# EAGLE design Mechaduino01 (EAGLE 7.3.0)
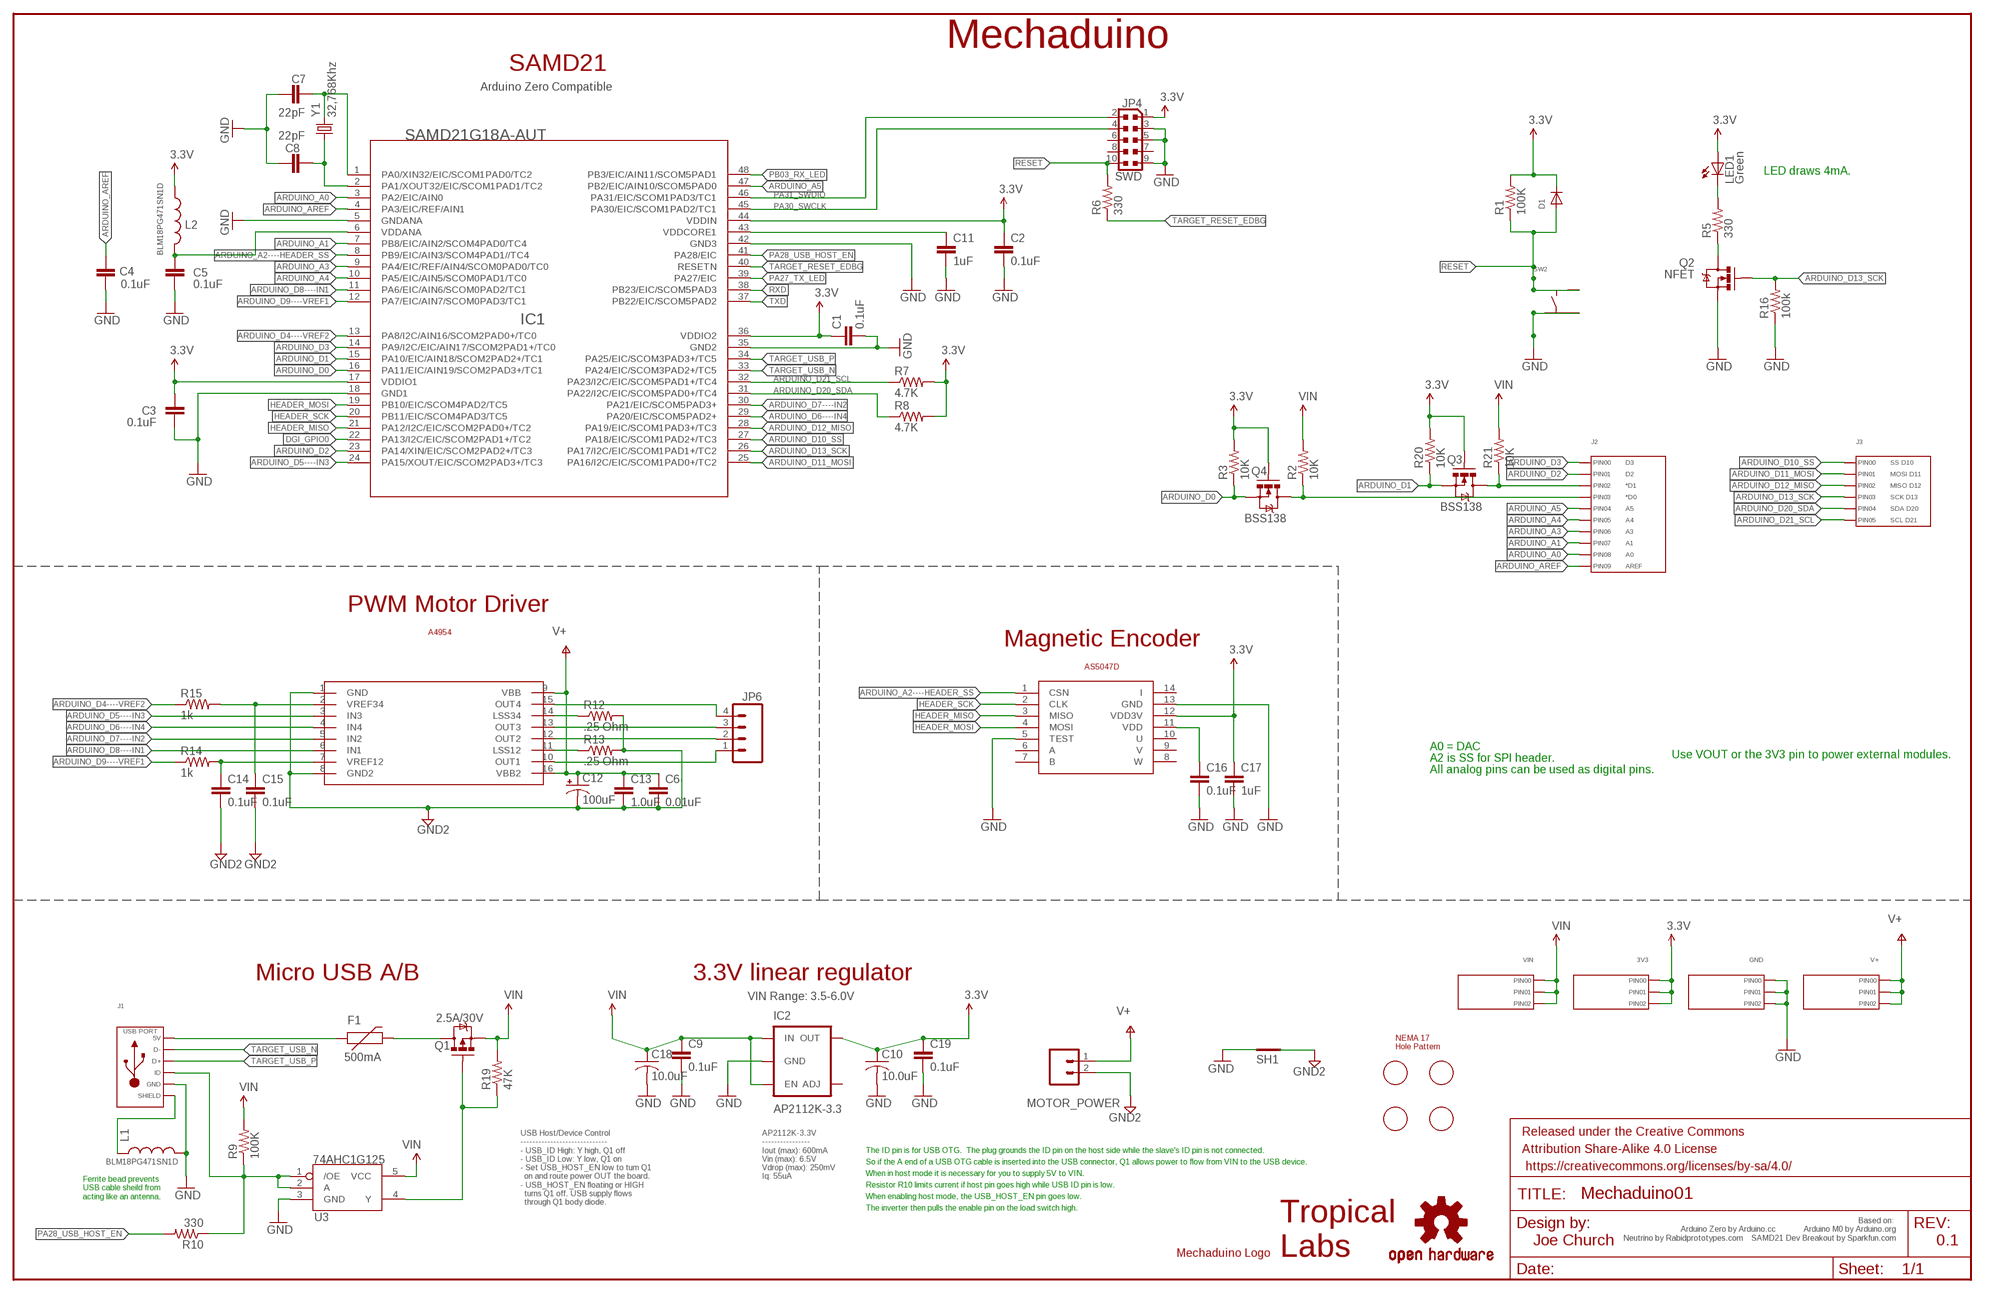
[diagram p0: schematic, sheet 1]

## Parts
3V3  HEADER_01X03_PTH_2.54MM  [PTH_2.54MM_01X03]
C1  0.1uF  CAP0402  [0402-CAP]
C2  0.1uF  CAP0402  [0402-CAP]
C3  0.1uF  CAP0402  [0402-CAP]
C4  0.1uF  CAP0402  [0402-CAP]
C5  0.1uF  CAP0402  [0402-CAP]
C6  0.01uF  CAP0402  [0402-CAP]
C7  22pF  CAP0402  [0402-CAP]
C8  22pF  CAP0402  [0402-CAP]
C9  0.1uF  CAP0402  [0402-CAP]
C10  10.0uF  C-USC0805  [C0805]
C11  1uF  CAP0402  [0402-CAP]
C12  100uF  CAP_POLD  [PANASONIC_D]
C13  1.0uF  CAP0603  [0603-CAP]
C14  0.1uF  CAP0402  [0402-CAP]
C15  0.1uF  CAP0402  [0402-CAP]
C16  0.1uF  CAP0402  [0402-CAP]
C17  1uF  CAP0402  [0402-CAP]
C18  10.0uF  C-USC0805  [C0805]
C19  0.1uF  CAP0402  [0402-CAP]
D1  DIODESOD-523  [SOD-523]
F1  500mA  PTCSMD  [PTC-1206]
FRAME1  FRAME-LEDGER  [CREATIVE_COMMONS]
GND  HEADER_01X03_PTH_2.54MM  [PTH_2.54MM_01X03]
IC1  SAMD21G18A-AUT  INTEGRATEDCIRCUITS_1792_SAMD21G18A-AUT  [INTEGRATEDCIRCUITS_TQFP48-7X7]
IC2  AP2112K-3.3  AP2202-ADJ  [SOT23-5@1]
J1  USB_MICRO_RIGHT  [MICROUSB-RIGHT]
J2  HEADER_01X10_PTH_2.54MM  [PTH_2.54MM_01X10]
J3  HEADER_01X06_PTH_2.54MM  [PTH_2.54MM_01X06]
JP4  SWD  CONNETTORI_0171_PH127-205DF055G00A  [CONNETTORI_PINHEAD-2X5-P127]
JP6  M04PTH  [1X04]
L1  BLM18PG471SN1D  INDUCTOR0603-TDK  [0603-TDK]
L2  BLM18PG471SN1D  INDUCTOR0603-TDK  [0603-TDK]
LED1  Green  0044_KPT-2012YC  [CHIPLED_0805]
LOGO4  OSHW-LOGOL-COPPER  [OSHW-LOGO-L_COPPER]
MOTOR_POWER  M025MM  [SCREWTERMINAL-5MM-2]
Q1  2.5A/30V  MOSFET-PCHANNELDMG2307L  [SOT23-3]
Q2  NFET  MOSFET-NCHANNEL2N7002PW  [SOT323]
Q3  BSS138  MOSFET-NCHANNELSMD  [SOT23-3]
Q4  BSS138  MOSFET-NCHANNELSMD  [SOT23-3]
R1  100K  R-US_R0402-VISHAY  [R0402-VISHAY]
R2  10K  R-US_R0402-VISHAY  [R0402-VISHAY]
R3  10K  R-US_R0402-VISHAY  [R0402-VISHAY]
R5  330  R-US_R0402-VISHAY  [R0402-VISHAY]
R6  330  R-US_R0402-VISHAY  [R0402-VISHAY]
R7  4.7K  R-US_R0402-VISHAY  [R0402-VISHAY]
R8  4.7K  R-US_R0402-VISHAY  [R0402-VISHAY]
R9  100K  R-US_R0402-VISHAY  [R0402-VISHAY]
R10  330  R-US_R0402-VISHAY  [R0402-VISHAY]
R12  .25 Ohm  R-US_R1206  [R1206]
R13  .25 Ohm  R-US_R1206  [R1206]
R14  1k  R-US_R0402-VISHAY  [R0402-VISHAY]
R15  1k  R-US_R0402-VISHAY  [R0402-VISHAY]
R16  100k  R-US_R0402-VISHAY  [R0402-VISHAY]
R19  47K  47KOHM1/10W1%(0603)  [0603-RES]
R20  10K  R-US_R0402-VISHAY  [R0402-VISHAY]
R21  10K  R-US_R0402-VISHAY  [R0402-VISHAY]
SH1  SHORT-HA5  [SHORT_ALL-50]
SW2  TACT_4.2MM  [TACT4.2MM]
U3  74AHC1G125  [SOT23-5]
U$1  AVAGO_DRIVER  [TSSOP16]
U$2  NEMA17_HOLE_PATTERN  [NEMA17_HOLE_PATTERN]
U$3  TROPICAL_LABS_LOGO_1LOGO3  [LOGO3]
U$4  AS5047D  [TSSOP14]
U$5  MECHADUINO_LOGO  [MECHADUINO_LOGO]
V+  HEADER_01X03_PTH_2.54MM  [PTH_2.54MM_01X03]
VIN  HEADER_01X03_PTH_2.54MM  [PTH_2.54MM_01X03]
Y1  32,768Khz  CRYSTAL2012  [CRYSTAL-SMD-2.0X1.2]

## Nets
3.3V: 3V3.P$1(PIN0) 3V3.P$2(PIN1) 3V3.P$3(PIN2) C1.1 C2.1 C3.2 C10.1 C17.1 C19.1 D1.K(C) IC1.17(VDDIO1) IC1.36(VDDIO2) IC1.44(VDDIN) IC2.5(OUT) JP4.1 L2.1 LED1.A Q3.1(G) Q4.1(G) R1.2 R3.2 R7.2 R8.2 R20.2 U$4.12(VDD3V)
ARDUINO_A0: IC1.3(PA2/EIC/AIN0) J2.P$9(PIN8)
ARDUINO_A1: IC1.7(PB8/EIC/AIN2/SCOM4PAD0/TC4) J2.P$8(PIN7)
ARDUINO_A2----HEADER_SS: IC1.8(PB9/EIC/AIN3/SCOM4PAD1//TC4) U$4.1(CSN)
ARDUINO_A3: IC1.9(PA4/EIC/REF/AIN4/SCOM0PAD0/TC0) J2.P$7(PIN6)
ARDUINO_A4: IC1.10(PA5/EIC/AIN5/SCOM0PAD1/TC0) J2.P$6(PIN5)
ARDUINO_A5: IC1.47(PB2/EIC/AIN10/SCOM5PAD0) J2.P$5(PIN4)
ARDUINO_AREF: C4.1 IC1.4(PA3/EIC/REF/AIN1) J2.P$10(PIN9)
ARDUINO_D0: IC1.16(PA11/EIC/AIN19/SCOM2PAD3+/TC1) Q4.2(S) R3.1
ARDUINO_D1: IC1.15(PA10/EIC/AIN18/SCOM2PAD2+/TC1) Q3.2(S) R20.1
ARDUINO_D2: IC1.23(PA14/XIN/EIC/SCOM2PAD2+/TC3) J2.P$2(PIN1)
ARDUINO_D3: IC1.14(PA9/I2C/EIC/AIN17/SCOM2PAD1+/TC0) J2.P$1(PIN0)
ARDUINO_D4----VREF2: IC1.13(PA8/I2C/AIN16/SCOM2PAD0+/TC0) R15.1
ARDUINO_D5----IN3: IC1.24(PA15/XOUT/EIC/SCOM2PAD3+/TC3) U$1.3(IN3)
ARDUINO_D6----IN4: IC1.29(PA20/EIC/SCOM5PAD2+) U$1.4(IN4)
ARDUINO_D7----IN2: IC1.30(PA21/EIC/SCOM5PAD3+) U$1.5(IN2)
ARDUINO_D8----IN1: IC1.11(PA6/EIC/AIN6/SCOM0PAD2/TC1) U$1.6(IN1)
ARDUINO_D9----VREF1: IC1.12(PA7/EIC/AIN7/SCOM0PAD3/TC1) R14.1
ARDUINO_D10_SS: IC1.27(PA18/EIC/SCOM1PAD2+/TC3) J3.P$1(PIN0)
ARDUINO_D11_MOSI: IC1.25(PA16/I2C/EIC/SCOM1PAD0+/TC2) J3.P$2(PIN1)
ARDUINO_D12_MISO: IC1.28(PA19/EIC/SCOM1PAD3+/TC3) J3.P$3(PIN2)
ARDUINO_D13_SCK: IC1.26(PA17/I2C/EIC/SCOM1PAD1+/TC2) J3.P$4(PIN3) Q2.1(G) R16.2
ARDUINO_D20_SDA: IC1.31(PA22/I2C/EIC/SCOM5PAD0+/TC4) J3.P$5(PIN4) R8.1
ARDUINO_D21_SCL: IC1.32(PA23/I2C/EIC/SCOM5PAD1+/TC4) J3.P$6(PIN5) R7.1
DGI_GPIO0: IC1.22(PA13/I2C/EIC/SCOM2PAD1+/TC2)
GND [gnd]: C1.2 C2.2 C3.1 C4.2 C5.2 C7.1 C8.1 C9.2 C10.2 C11.2 C16.2 C17.2 C18.2 C19.2 GND.P$1(PIN0) GND.P$2(PIN1) GND.P$3(PIN2) IC1.5(GNDANA) IC1.18(GND1) IC1.35(GND2) IC1.42(GND3) IC2.2(GND) J1.5(GND) JP4.3 JP4.5 JP4.9 L1.2 Q2.2(S) R16.1 SH1.2 SW2.P$3 SW2.P$4 U3.3(GND) U$4.5(TEST) U$4.13(GND)
GND2 [gnd]: C6.2 C12.- C13.2 C14.2 C15.2 MOTOR_POWER.2 R12.2 R13.2 SH1.1 U$1.1(GND) U$1.8(GND2)
HEADER_MISO: IC1.21(PA12/I2C/EIC/SCOM2PAD0+/TC2) U$4.3(MISO)
HEADER_MOSI: IC1.19(PB10/EIC/SCOM4PAD2/TC5) U$4.4(MOSI)
HEADER_SCK: IC1.20(PB11/EIC/SCOM4PAD3/TC5) U$4.2(CLK)
HV1: J2.P$3(PIN2) Q3.3(D) R21.1
HV2: J2.P$4(PIN3) Q4.3(D) R2.1
N$1: LED1.C R5.2
N$2: R12.1 U$1.14(LSS34)
N$3: Q2.3(D) R5.1
N$4: R13.1 U$1.11(LSS12)
N$6: C15.1 R15.2 U$1.2(VREF34)
N$7: J1.4(ID) R9.1 R10.1 U3.1(/OE) U3.2(A)
N$13: JP6.4 U$1.15(OUT4)
N$14: JP6.1 U$1.10(OUT1)
N$15: JP6.2 U$1.12(OUT2)
N$16: JP6.3 U$1.13(OUT3)
N$27: C16.1 U$4.11(VDD)
N$32: C14.1 R14.2 U$1.7(VREF12)
N$33: F1.2 Q1.3(D)
N$34: Q1.1(G) R19.1 U3.4(Y)
N$36 [usbvcc]: F1.1 J1.1(5V)
PA00_XIN32: C7.2 IC1.1(PA0/XIN32/EIC/SCOM1PAD0/TC2) Y1.2
PA01_XOUT32: C8.2 IC1.2(PA1/XOUT32/EIC/SCOM1PAD1/TC2) Y1.1
PA27_TX_LED: IC1.39(PA27/EIC)
PA28_USB_HOST_EN: IC1.41(PA28/EIC) R10.2
PA30_SWCLK: IC1.45(PA30/EIC/SCOM1PAD2/TC1) JP4.4
PA31_SWDIO: IC1.46(PA31/EIC/SCOM1PAD3/TC1) JP4.2
PB03_RX_LED: IC1.48(PB3/EIC/AIN11/SCOM5PAD1)
RESET: D1.A JP4.10 R1.1 R6.2 SW2.P$1 SW2.P$2
RXD: IC1.38(PB23/EIC/SCOM5PAD3)
SHIELD [gnd]: J1.S1(SLD) J1.S2(SLD) J1.S3(SLD) J1.S4(SLD) J1.S5(SLD) J1.S6(SLD) J1.S7(SLD) J1.S8(SLD) L1.1
TARGET_RESET_EDBG: IC1.40(RESETN) R6.1
TARGET_USB_N [USBpair]: IC1.33(PA24/EIC/SCOM3PAD2+/TC5) J1.2(D-)
TARGET_USB_P [USBpair]: IC1.34(PA25/EIC/SCOM3PAD3+/TC5) J1.3(D+)
TXD: IC1.37(PB22/EIC/SCOM5PAD2)
V+: C6.1 C12.+ C13.1 MOTOR_POWER.1 U$1.9(VBB) U$1.16(VBB2) V+.P$1(PIN0) V+.P$2(PIN1) V+.P$3(PIN2)
VDDANA: C5.1 IC1.6(VDDANA) L2.2
VDDCORE: C11.1 IC1.43(VDDCORE1)
VIN [usbvcc]: C9.1 C18.1 IC2.1(IN) IC2.3(EN) Q1.2(S) R2.2 R9.2 R19.2 R21.2 U3.5(VCC) VIN.P$1(PIN0) VIN.P$2(PIN1) VIN.P$3(PIN2)
Unconnected: IC2.4(ADJ) JP4.6 JP4.7 JP4.8 U$4.6(A) U$4.7(B) U$4.8(W) U$4.9(V) U$4.10(U) U$4.14(I)

## Notes on the sheet
- Mechaduino
- SAMD21
- Arduino Zero Compatible
- LED draws 4mA.
- PWM Motor Driver
- A4954
- Magnetic Encoder
- A0 = DAC | Use VOUT or the 3V3 pin to power external modules.
- A2 is SS for SPI header.
- All analog pins can be used as digital pins.
- Micro USB A/B | 3.3V linear regulator
- VIN Range: 3.5-6.0V
- USB Host/Device Control
  -----------------------------
  - USB_ID High: Y high, Q1 off
  - USB_ID Low: Y low, Q1 on
  - Set USB_HOST_EN low to turn Q1
    on and route power OUT the board.
  - USB_HOST_EN floating or HIGH
    turns Q1 off. USB supply flows
    through Q1 body diode.
- AP2112K-3.3V
  ----------------
  Iout (max): 600mA 
  Vin (max): 6.5V
  Vdrop (max): 250mV
  Iq: 55uA
- The ID pin is for USB OTG.  The plug grounds the ID pin on the host side while the slave's ID pin is not connected.
- So if the A end of a USB OTG cable is inserted into the USB connector, Q1 allows power to flow from VIN to the USB device.
- When in host mode it is necessary for you to supply 5V to VIN.
- Resistor R10 limits current if host pin goes high while USB ID pin is low.
- Ferrite bead prevents 
  USB cable sheild from 
  acting like an antenna.
- When enabling host mode, the USB_HOST_EN pin goes low.
- The inverter then pulls the enable pin on the load switch high.
- Based on: 
  Arduino Zero by Arduino.cc              Arduino M0 by Arduino.org
  Neutrino by Rabidprototypes.com    SAMD21 Dev Breakout by Sparkfun.com
- Joe Church | 0.1

## Library data of the parts
3V3 GND V+ VIN = MF_Connectors:HEADER_01X03: Library: MF_Connectors Description: Header Connector with 03 Positions and 01 Rows. Use the LABEL Attribute to label the pin on the schematic and PCB. You can remove the attributes on the PCB by using the SMASH function on the part and then deleting the text.
C1-C9 C11 C13-C17 C19 = swift:CAP: Capacitor Standard 0603 ceramic capacitor, and 0.1" leaded capacitor.
C10 C18 = rcl:C-US: CAPACITOR, American symbol
C12 = SparkFun-Capacitors:CAP_POL: Capacitor Polarized These are standard SMD and PTH capacitors. Normally 10uF, 47uF, and 100uF in electrolytic and tantalum varieties. Always verify the external diameter of the through hole cap, it varies with capacity, voltage, and manufacturer. The EIA devices should be standard.
D1 = adafruit:DIODE: Diode SMADIODE - SMA Surface Mount Package 20V 1A Schottky Diode Digikey: 641-1014-6-ND DO-1N4148 - Through Hole Small Current Diode SOD-123 20V 1 A (.5mV Vf) Schottky Diode - Digikey: MBRX120TPMSCT-ND SOD-323 10V 570mA (.38mV Vf, 3ns) Schottky Diode - Digikey: ZLLS410CT-ND SOD-523 30V 30mA Schottky Diode (RB751S-40TE61) - Digikey: RB751S-40TE61CT-ND SOT23-R/W - SOT23 Package (R = Solder Paste/Reflow Ovens, W = Hand-Soldering) BAT54Film 40V 300mA - Digikey: 497-7162-1-ND
F1 = SparkFun-PowerIC:PTC: Resettable Fuse PTC Resettable Fuse. Spark Fun Electronics SKU : COM-08357; PROD_ID: RES-11150
FRAME1 = SparkFun-Aesthetics:FRAME-LEDGER: Schematic Frame Standard 11x14 US Ledger frame
IC1 = Arduino-Neutrino-082:INTEGRATEDCIRCUITS_1792_SAMD21G18A-AUT: Atmel D21 32bit ARM Cortex-M0 microcontroller - 48 PIN TQFP 256KB flash memory + 32KB SRAM
IC2 = SparkFun-PowerIC:AP2202-ADJ: AP2202 Adjustable LDO Diodes Inc small, low-cost LDO 150mA, 13.2V, less than 200mV dropout; PROD_ID: VREG-12189; VALUE: AP2202-ADJ
J1 = MF_Connectors:USB: Library: MF_Connectors Description: 5 Pin USB Connectors. SLD is the shield connection. Usually tied to ground through a small ferrite bead.
J2 = MF_Connectors:HEADER_01X10: Library: MF_Connectors Description: Header Connector with 10 Positions and 01 Rows. Use the LABEL Attribute to label the pin on the schematic and PCB. You can remove the attributes on the PCB by using the SMASH function on the part and then deleting the text.; LABEL00: D3; LABEL01: D2; LABEL02: *D1; LABEL03: *D0; LABEL04: A5; LABEL05: A4; LABEL06: A3; LABEL07: A1; LABEL08: A0; LABEL09: AREF
J3 = MF_Connectors:HEADER_01X06: Library: MF_Connectors Description: Header Connector with 6 Positions and 01 Rows. Use the LABEL Attribute to label the pin on the schematic and PCB. You can remove the attributes on the PCB by using the SMASH function on the part and then deleting the text.; LABEL00: SS D10; LABEL01: MOSI D11; LABEL02: MISO D12; LABEL03: SCK D13; LABEL04: SDA D20; LABEL05: SCL D21
JP4 = Arduino-Neutrino-082:CONNETTORI_0171_PH127-205DF055G00A: 2x5 PASSO 1,27; VALUE: PINHEAD-2x5-P1.27
JP6 = SparkFun-Connectors:M04: Header 4 Standard 4-pin 0.1" header. Use with straight break away headers (SKU : PRT-00116), right angle break away headers (PRT-00553), swiss pins (PRT-00743), machine pins (PRT-00117), and female headers (PRT-00115). Molex polarized connector foot print use with SKU : PRT-08231 with associated crimp pins and housings. 1MM SMD Version SKU: PRT-10208
L1 L2 = SparkFun-Passives:INDUCTOR: Inductors Basic Inductor/Choke - 0603 and 1206. Footprints are not proven and vary greatly between part numbers. SRN6045- 33uH, 20% 1.4A SDR0403-560KL - 56uH, 10%, 500mA RMS/740mA peak
LED1 = Opto:0044_KPT-2012YC: LED YELLOW - SMD - 0805; MONTHLY_USAGE: _____; PART_NUMBER: KPT-2012YC; PRICE: _____; SUPPLIER: _____; TYPE: Opto; VALUE: Yellow
LOGO4 = SparkFun-Aesthetics:OSHW-LOGO: Open Source Hardware Logo This logo indicates the piece of hardware it is found on incorporates a OSHW license and/or adheres to the definition of open source hardware found here: http://freedomdefined.org/OSHW
MOTOR_POWER = SparkFun-Connectors:M02: Standard 2-pin 0.1" header. Use with - straight break away headers ( PRT-00116) - right angle break away headers (PRT-00553) - swiss pins (PRT-00743) - machine pins (PRT-00117) - female headers (PRT-00115) Molex polarized connector foot print use with: PRT-08233 with associated crimp pins and housings. 2.54_SCREWTERM for use with PRT-10571. 3.5mm Screw Terminal footprints for PRT-08084 5mm Screw Terminal footprints for use with PRT-08432; STOREFRONT_ID: PRT-08432
Q1 = SparkFun-DiscreteSemi:MOSFET-PCHANNEL: Generic PMOSFET IRLML2244 - TRANS-11153 (SOT-23 -20V -4.3A) (1.Gate 2.Source 3.Drain) FQP27P06 - COM-10349 <http://www.sparkfun.com/products/10349> (TO-220 -60V -27A) (1.Gate 2.Source 3.Drain); PROD_ID: TRANS-11308
Q2 = SparkFun-DiscreteSemi:MOSFET-NCHANNEL: Common NMOSFET Parts MFG P/N Store ID Prod ID FDD8780 TRANS-09984 SI7820DN TRANS-11055 FDS6630A IC-08089 2N7002PW TRANS-11151 FQP30N06L COM-10213 TRANS-10060 BSS123LT1G TRANS-08345 BSS138 TRANS-00830 BS170 2N7000; PROD_ID: TRANS-11151
Q3 Q4 = SparkFun:MOSFET-NCHANNEL
R1-R3 R5-R10 R12-R16 R20 R21 = adafruit:R-US_: RESISTOR, American symbol
R19 = SparkFun-Resistors:47KOHM1/10W1%(0603): RES-07871; PROD_ID: RES-07871
SH1 = shorts-old:SHORT-H: Short between two nets; BOM: no
SW2 = MF_Switches:TACT: Library: MF_Switches Description: Device for Tact Switches. Manufacture part number (MFG#) can be added via Attributes.
U3 = SparkFun-DigitalIC:74AHC1G125: Single bus buffer gate with 3-state output; PROD_ID: IC-11920
U$1 = avagopack:AVAGO_DRIVER
U$2 = stepper_servo_prototype_1:NEMA17_HOLE_PATTERN
U$3 = stepper_servo_prototype_1:TROPICAL_LABS_LOGO_1
U$4 = stepper_servo_prototype_1:AS5047D
U$5 = stepper_servo_prototype_1:MECHADUINO_LOGO
Y1 = SparkFun-FreqCtrl:CRYSTAL: Various standard crystals. Proven footprints. Spark Fun Electronics SKU : COM-00534

## Net classes
2 gnd: width 0.152 mm, drill 0.305 mm, clearance 0.152 mm
3 usbvcc: width 0.152 mm, drill 0.305 mm, clearance 0.152 mm
4 USBpair: width 0.152 mm, drill 0.305 mm, clearance 0.152 mm

## Board
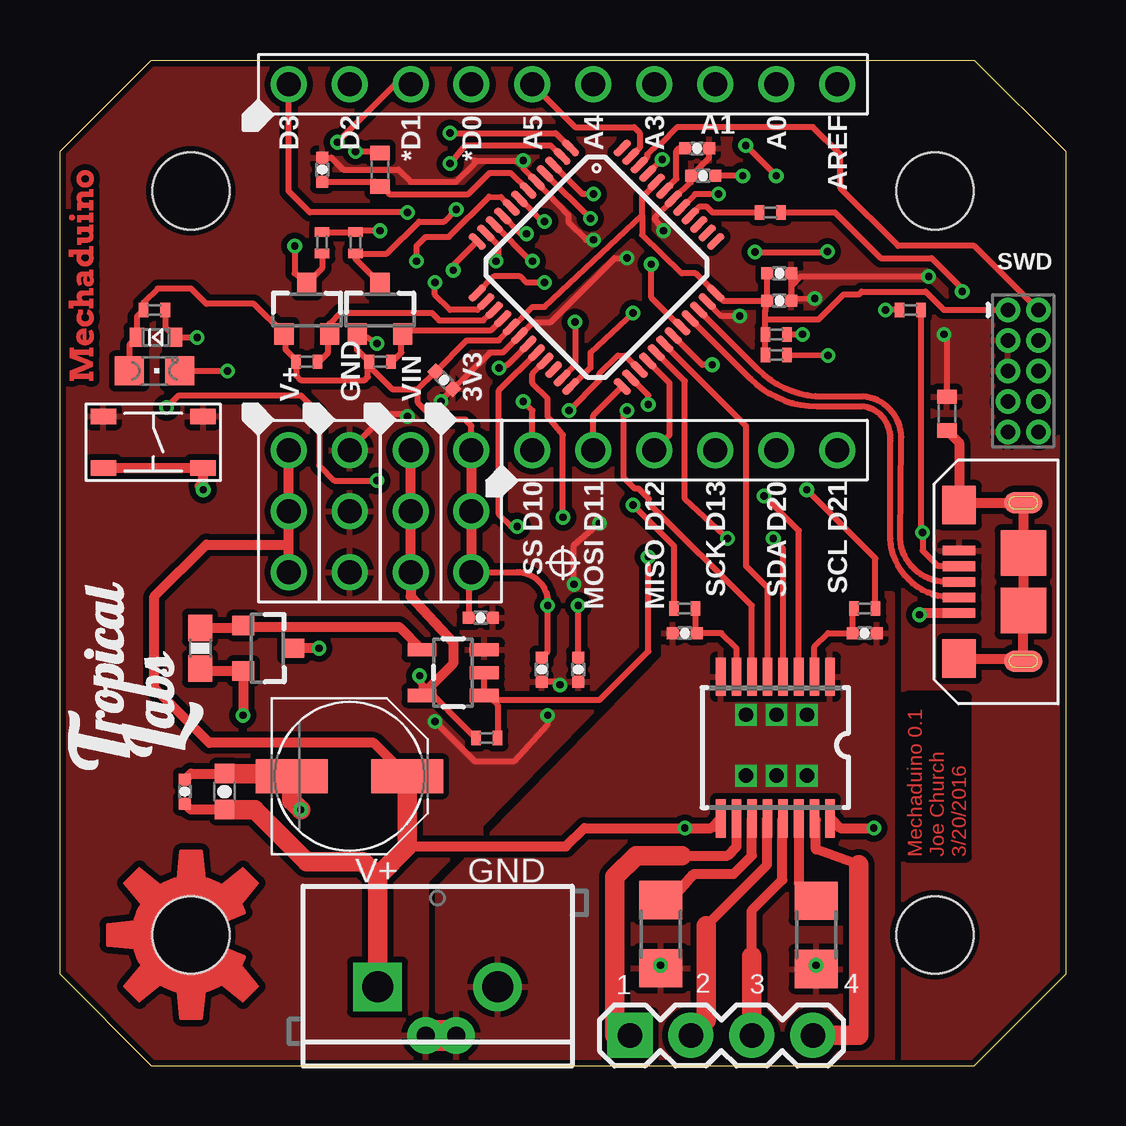
[diagram p1: board, top side]
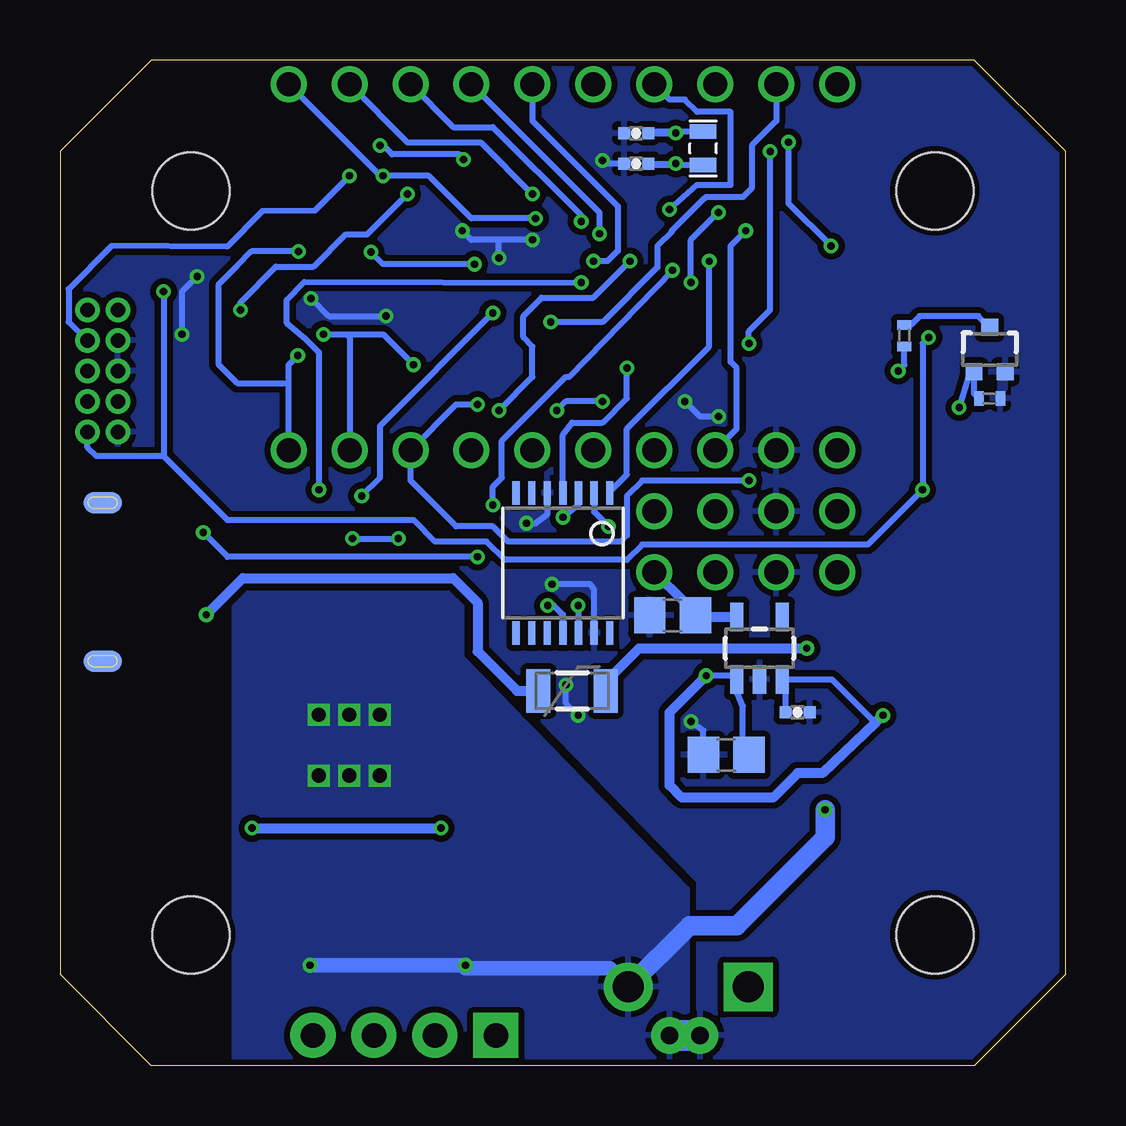
[diagram p2: board, bottom side, seen from below]

Size 41.91 x 41.91 mm. Coordinates in mm from the lower left corner, seen from the top.
Outline: 3.81,0 38.1,0 41.91,3.81 41.91,38.1 38.1,41.91 3.81,41.91 0,38.1 0,3.81 3.81,0
Copper layers (1*16): Top 0.035mm / dielectric 0.2mm / Bottom 0.035mm
Design rules "MacroFabDRU": minimum track width 6mil, minimum drill 12mil, track to track 6mil, track to pad 6mil, pad to pad 6mil, via to via 6mil, smd to smd 0mil, copper to edge 10mil, drill to drill 10mil, minimum pad ring 6mil, minimum via ring 6mil, stop-mask expansion 2mil, vias tented up to drill 25mil, thermal gap 10mil

### Footprints (pad centres in the part's own frame; a part is rotated, then mirrored left to right if it is on the bottom)
PTH_2.54MM_01X03 = drill 1: P$1 -2.54,0; P$2 0,0; P$3 2.54,0
0402-CAP = smd 0.5 x 0.5: 1 -0.5,0; 2 0.5,0
C0805 = smd 1.3 x 1.5: 1 -0.95,0; 2 0.95,0
PANASONIC_D = smd 3 x 1.4: + 2.4,0; - -2.4,0
0603-CAP = smd 0.8 x 0.8: 1 -0.75,0; 2 0.75,0
SOD-523 = smd 0.8 x 0.6: A 0,-0.8; K 0,0.8
PTC-1206 = smd 1 x 1.8: 1 -1.4,0; 2 1.4,0
INTEGRATEDCIRCUITS_TQFP48-7X7 = smd 0.85 x 0.32: 1 -4.275,2.75; 2 -4.275,2.25; 3 -4.275,1.75; 4 -4.275,1.25; 5 -4.275,0.75; 6 -4.275,0.25; 7 -4.275,-0.25; 8 -4.275,-0.75; 9 -4.275,-1.25; 10 -4.275,-1.75; 11 -4.275,-2.25; 12 -4.275,-2.75; 25 4.275,-2.75; 26 4.275,-2.25; 27 4.275,-1.75; 28 4.275,-1.25; 29 4.275,-0.75; 30 4.275,-0.25; 31 4.275,0.25; 32 4.275,0.75; 33 4.275,1.25; 34 4.275,1.75; 35 4.275,2.25; 36 4.275,2.75 | smd 0.32 x 0.85: 13 -2.75,-4.275; 14 -2.25,-4.275; 15 -1.75,-4.275; 16 -1.25,-4.275; 17 -0.75,-4.275; 18 -0.25,-4.275; 19 0.25,-4.275; 20 0.75,-4.275; 21 1.25,-4.275; 22 1.75,-4.275; 23 2.25,-4.275; 24 2.75,-4.275; 37 2.75,4.275; 38 2.25,4.275; 39 1.75,4.275; 40 1.25,4.275; 41 0.75,4.275; 42 0.25,4.275; 43 -0.25,4.275; 44 -0.75,4.275; 45 -1.25,4.275; 46 -1.75,4.275; 47 -2.25,4.275; 48 -2.75,4.275
SOT23-5@1 = smd 0.55 x 1.2: 1 -0.95,-1.3; 2 0,-1.3; 3 0.95,-1.3; 4 0.95,1.3; 5 -0.95,1.3
MICROUSB-RIGHT = smd 0.4 x 1.35: 1 -1.3,1.27; 2 -0.65,1.27; 3 0,1.27; 4 0.65,1.27; 5 1.3,1.27 | smd 0.9 x 1.6: S1 -3.3,-1.4; S2 3.3,-1.4 | smd 1.6 x 1.4: S3 -3.2,1.27; S4 3.2,1.27 | smd 1.9 x 1.9: S5 -1.2,-1.405; S6 1.2,-1.405 | smd 0.9 x 1.6 bottom: S7 -3.3,-1.4; S8 3.3,-1.4
PTH_2.54MM_01X10 = drill 1: P$1 -11.43,0; P$2 -8.89,0; P$3 -6.35,0; P$4 -3.81,0; P$5 -1.27,0; P$6 1.27,0; P$7 3.81,0; P$8 6.35,0; P$9 8.89,0; P$10 11.43,0
PTH_2.54MM_01X06 = drill 1: P$1 -6.35,0; P$2 -3.81,0; P$3 -1.27,0; P$4 1.27,0; P$5 3.81,0; P$6 6.35,0
CONNETTORI_PINHEAD-2X5-P127 = drill 0.61 pad 1.016: 1 -0.635,2.54; 2 0.635,2.54; 3 -0.635,1.27; 4 0.635,1.27; 5 -0.635,0; 6 0.635,0; 7 -0.635,-1.27; 8 0.635,-1.27; 9 -0.635,-2.54; 10 0.635,-2.54
1X04 = drill 1.016 pad 1.88 square: 1 0,0 | drill 1.016 pad 1.88: 2 2.54,0; 3 5.08,0; 4 7.62,0
0603-TDK = smd 0.6 x 0.8: 1 -0.7,0; 2 0.7,0
CHIPLED_0805 = smd 1.2 x 1.2: A 0,-1.05; C 0,1.05
SCREWTERMINAL-5MM-2 = drill 1.3 pad 2.032 square: 1 0,0 | drill 1.3 pad 2.032: 2 5,0
SOT23-3 = smd 0.8 x 0.9: 1 -0.95,-1; 2 0.95,-1; 3 0,1.1
SOT323 = smd 0.7 x 0.7: 1 -0.65,-0.925; 2 0.65,-0.925; 3 0,0.925
R0402-VISHAY = smd 0.4 x 0.6: 1 -0.45,0; 2 0.45,0
R1206 = smd 1.6 x 1.803: 1 -1.422,0; 2 1.422,0
0603-RES = smd 1.1 x 1: 1 -0.85,0; 2 0.85,0
SHORT_ALL-50 = drill 0.737 pad 1.524: 1 -0.635,0; 2 0.635,0
TACT4.2MM = smd 1.05 x 0.65: P$1 -2.075,1.075; P$2 2.075,1.075; P$3 -2.075,-1.075; P$4 2.075,-1.075
SOT23-5 = smd 0.55 x 1.2: 1 -0.95,-1.3; 2 0,-1.3; 3 0.95,-1.3; 4 0.95,1.3; 5 -0.95,1.3
TSSOP16 = smd 0.4 x 1.6: 1 -2.225,-2.85; 2 -1.575,-2.85; 3 -0.925,-2.85; 4 -0.275,-2.85; 5 0.375,-2.85; 6 1.025,-2.85; 7 1.675,-2.85; 8 2.325,-2.85; 9 2.325,3.05; 10 1.675,3.05; 11 1.025,3.05; 12 0.375,3.05; 13 -0.275,3.05; 14 -0.925,3.05; 15 -1.575,3.05; 16 -2.225,3.05
NEMA17_HOLE_PATTERN = hole 3.2: -15.5,15.5; -15.5,-15.5; 15.5,-15.5; 15.5,15.5
TSSOP14 = smd 0.305 x 0.991: 1 -1.95,-2.918; 2 -1.3,-2.918; 3 -0.65,-2.918; 4 0,-2.918; 5 0.65,-2.918; 6 1.3,-2.918; 7 1.95,-2.918; 8 1.95,2.918; 9 1.3,2.918; 10 0.65,2.918; 11 0,2.918; 12 -0.65,2.918; 13 -1.3,2.918; 14 -1.95,2.918
CRYSTAL-SMD-2.0X1.2 = smd 0.6 x 1.1: 1 -0.7,0; 2 0.7,0

### Placement (x,y rotation side)
3V3  17.14,23.11 270 top
C1  29.97,31.88 0 top
C2  29.97,33.02 0 top
C3  16,28.57 135 top
C4  26.8,37.08 180 top
C5  10.92,37.34 90 top
C6  5.21,11.43 90 top
C7  17.91,38.86 0 bottom
C8  17.91,37.59 0 bottom
C9  11.18,14.73 0 bottom
C10  16.38,18.77 180 bottom
C11  26.54,38.23 0 top
C12  12.06,12.06 0 top
C13  6.86,11.43 90 top
C14  26.04,18.03 180 top
C15  33.53,18.03 0 top
C16  21.59,16.51 270 top
C17  20.07,16.51 270 top
C18  14.15,12.95 180 bottom
C19  17.53,18.67 0 top
D1  4,30.35 90 top
F1  20.57,15.62 0 bottom
FRAME1  0.61,-10.16 0 top  (outside the outline)
GND  12.06,23.11 270 top
IC1  22.35,33.27 315 top
IC2  12.76,17.4 0 bottom
J1  38.73,20.17 90 top
J2  20.95,40.89 0 top
J3  26.04,25.65 0 top
JP4  40.13,28.96 0 top
JP6  23.75,1.27 0 top
L1  36.96,27.18 90 top
L2  13.34,37.34 270 top
LED1  3.94,28.96 270 top
LOGO4  5.46,5.46 90 top
MOTOR_POWER  13.23,3.29 0 top
Q1  8.64,17.4 270 top
Q2  3.17,29.84 0 bottom
Q3  10.29,31.5 0 top
Q4  13.34,31.5 0 top
R1  3.94,31.5 180 top
R2  12.32,34.29 90 top
R3  13.34,29.34 180 top
R5  6.73,30.42 270 bottom
R6  29.59,35.56 0 top
R7  29.84,29.62 180 top
R8  29.84,30.48 180 top
R9  17.78,13.65 180 top
R10  35.43,31.5 180 top
R12  .15 Ohm  [R1206]  31.51,5.46 270 top
R13  .15 Ohm  [R1206]  25.03,5.49 270 top
R14  26.04,19.05 0 top
R15  33.53,19.05 180 top
R16  3.17,27.81 180 bottom
R19  5.84,17.4 270 top
R20  10.29,29.34 180 top
R21  10.92,34.29 90 top
SH1  15.88,1.27 180 top
SW2  3.89,25.98 180 top
U3  16.38,16.38 90 top
U$1  29.86,13.36 180 top
U$2  20.95,20.95 0 top
U$3  6.1,12.19 90 top
U$4  20.95,20.95 180 bottom
U$5  1.52,28.45 90 top
V+  9.53,23.11 270 top
VIN  14.61,23.11 270 top
Y1  15.11,38.23 90 bottom

### Tracks (layer width: path | path; a pad name or v marks a point on that pad's centre or on a via)
3.3V  (via drill 0.3)
  Top 0.254: C19.1 17.03,20.33 3V3.P$3 19.05,20.57 arc-90 20.32,19.3 v20.32,19.18 20.32,17.26 C17.1 | R7.2 R8.2 29.39,31.09 | 29.39,31.09 29.39,31.45 C1.1 | C1.1 C2.1 | C1.1 27.64,31.88 IC1.36 26.5,33.02 25.91,33.02 24.26,34.62 24.26,35.43 | C1.1 | 24.26,35.43 24.26,36.2 24.84,36.78 IC1.44 | C1.1 | JP4.1 36.83,31.5 36.07,32.26 33.4,32.26 33.27,32.13 32.64,32.13 31.6,31.09 29.39,31.09 | R3.2 12.38,29.84 Q4.1 12.51,30.54 v13.21,30.1 | R3.2 12.83,29.28 12.83,28.7 12.7,28.57 10.03,28.57 9.84,28.77 R20.2 9.84,29.41 9.4,29.84 9.4,30.43 Q3.1 8.08,31.75 6.1,31.75 5.46,32.38 4.06,32.38 3.49,31.81 R1.2 3.2,31.21 D1.K 2.89,30.04 LED1.A | 18.84,30.78 18.29,30.23 16.95,30.23 C3.2 14.91,28.19 | 18.84,30.78 IC1.17 | R3.2 12.88,29.15 13.84,28.19 14.91,28.19 | 3V3.P$1 17.14,26.67 16.89,26.92 15.62,26.92 14.91,27.63 14.91,28.19 | v12.32,38.1 13.4,38.1 L2.1 | 18.84,30.78 19.68,31.62 20.19,31.62 24.26,35.43
  Top 0.406: 3V3.P$1 3V3.P$2 3V3.P$3
  Bottom 0.254: 15.49,18.7 C10.1 | v20.32,19.18 20.32,18.05 arc-90 U$4.12 | v13.21,30.1 13.21,30.61 12.32,31.5 v12.32,38.1
  Bottom 0.406: IC2.5 15.49,18.7 | C10.1 15.88,19.31 3V3.P$3
ARDUINO_A0  (via drill 0.3)
  Top 0.254: v22.23,36.32 21.78,36.32 IC1.3
  Bottom 0.254: J2.P$9 27.43,38.48 24.38,38.48 v22.23,36.32
ARDUINO_A1  (via drill 0.3)
  Top 0.254: v20.19,35.18 20.09,35.18 IC1.7
  Bottom 0.254: J2.P$8 25.53,39.12 23.88,39.12 20.19,35.43 v20.19,35.18
ARDUINO_A2----HEADER_SS  (via drill 0.3)
  Top 0.254: v14.86,33.53 14.86,34.16 15.24,34.54 16.2,34.54 17.88,36.22 18.37,36.2 IC1.8
  Bottom 0.254: U$4.1 19,23.92 18.29,24.64 18.29,26.54 14.86,29.97 v14.86,33.53
ARDUINO_A3  (via drill 0.3)
  Top 0.254: v19.43,34.67 19.19,34.67 IC1.9
  Bottom 0.254: J2.P$7 19.43,35.56 v19.43,34.67
ARDUINO_A4  (via drill 0.3)
  Top 0.254: v19.68,33.53 19.62,33.53 IC1.10
  Bottom 0.254: J2.P$6 22.23,39.37 18.67,35.81 18.67,33.96 19.1,33.53 v19.68,33.53
ARDUINO_A5
  Top 0.254: J2.P$5 21.46,39.12 23.93,39.12 24.16,38.89 24.16,38.25 23.79,37.89 IC1.47
ARDUINO_AREF  (via drill 0.3)
  Top 0.254: v28.45,37.08 C4.1 | IC1.4 20.22,37.18 v22.1,35.31
  Bottom 0.254: J2.P$10 28.57,37.08 v28.45,37.08 26.54,37.08 24.77,35.31 v22.1,35.31
ARDUINO_D0
  Top 0.254: R3.1 13.84,29.34 14.22,29.72 14.22,30.43 Q4.2 14.5,30.66 17.97,30.66 IC1.16
ARDUINO_D1
  Top 0.254: R20.1 10.79,29.34 11.18,29.72 11.18,30.43 Q3.2 11.24,30.92 11.68,31.37 15.49,31.37 15.8,31.06 17.64,31.06 IC1.15
ARDUINO_D2  (via drill 0.3)
  Top 0.254: v21.46,30.99 21.46,29.2 IC1.23
  Bottom 0.254: J2.P$2 12.06,39.37 13.08,38.35 13.08,36.58 13.46,36.2 14.99,36.2 15.06,36.14 16.43,34.77 16.41,34.77 17.02,34.16 17.02,33.27 19.3,30.99 v21.46,30.99
ARDUINO_D3  (via drill 0.3)
  Top 0.254: IC1.14 17.39,31.5 16.26,31.5 15.62,32.13 v15.62,32.64 | v14.48,35.56 10.41,35.56 9.53,36.45 J2.P$1
  Bottom 0.254: v15.62,32.64 15.62,34.42 v14.48,35.56
ARDUINO_D4----VREF2  (via drill 0.3)
  Top 0.254: R15.1 33.98,21.14 v31.11,24 | v20.19,32.64 19.43,32.64 19.18,32.89 18.08,32.89 IC1.13
  Bottom 0.254: v31.11,24 31.11,29.72 31.67,30.28 32.46,30.94 32.46,31.93 31.73,32.66 v20.19,32.64
ARDUINO_D5----IN3  (via drill 0.3)
  Top 0.254: U$1.3 30.78,22.3 v29.34,23.75 | v23.88,31.37 22.1,29.72 22.1,29.08 21.32,28.31 IC1.24
  Bottom 0.254: v29.34,23.75 28.57,24.51 28.57,26.67 v23.88,31.37
ARDUINO_D6----IN4  (via drill 0.3)
  Top 0.254: U$1.4 30.13,21.56 v29.72,21.97 | v27.81,21.97 27.69,22.1 26.04,23.62 26.04,28.53 IC1.29
  Bottom 0.254: v29.72,21.97 v27.81,21.97
ARDUINO_D7----IN2
  Top 0.254: 29.46,16.26 U$1.5 29.46,16.23 29.46,19.94 28.57,20.83 28.57,26.67 25.2,30.05 IC1.30
ARDUINO_D8----IN1  (via drill 0.3)
  Top 0.203: U$1.6
  Top 0.254: U$1.6 28.83,19.17 24.54,23.44 24.54,23.62 24.11,24.05 23.95,24.05 23.5,24.51 23.5,27.18 v23.62,27.3 | v18.16,33.53 18.29,33.66 18.29,34.16 IC1.11
  Bottom 0.254: v23.62,27.3 22.23,28.7 22.23,29.97 22.61,30.35 22.61,31.24 21.84,32 19.68,32 v18.16,33.53
ARDUINO_D9----VREF1  (via drill 0.3)
  Top 0.254: R14.1 25.59,21.66 v23.88,23.37 | v16.38,33.15 16.38,33.35 IC1.12
  Bottom 0.254: v23.88,23.37 23.88,24.13 23.5,24.51 23.5,26.04 20.83,28.7 20.7,28.7 v16.38,33.15
ARDUINO_D10_SS  (via drill 0.3)
  Top 0.254: J3.P$1 19.68,27.3 v19.3,27.69 | v21.21,27.3 22.48,28.57 22.48,28.83 23.24,29.59 23.56,29.59 IC1.27
  Bottom 0.254: v19.3,27.69 20.83,27.69 v21.21,27.3
ARDUINO_D11_MOSI
  Top 0.254: J3.P$2 22.23,27.1 IC1.25
ARDUINO_D12_MISO
  Top 0.254: J3.P$3 25.4,26.29 25.4,28.45 24.49,29.36 IC1.28
ARDUINO_D13_SCK  (via drill 0.3)
  Top 0.254: v24.51,27.56 24.51,27.93 IC1.26 | v4.45,27.43 4.95,27.94 10.03,27.94 10.79,27.18 10.79,25.02 11.43,24.38 v13.21,24.38
  Bottom 0.254: v24.51,27.56 25.4,27.56 J3.P$4 27.3,24.38 25.4,22.48 23.88,22.48 23.24,21.84 18.54,21.84 18.29,22.1 18.29,23.75 17.65,24.38 v13.21,24.38 | R16.2 3.83,28.01 Q2.1 4.06,28.68 v4.45,27.43
ARDUINO_D20_SDA  (via drill 0.3)
  Top 0.254: R8.1 v30.94,30.48 | v27.18,29.21 26.77,29.21 IC1.31
  Bottom 0.254: v30.94,30.48 29.97,30.48 | 29.97,30.48 29.84,30.35 J3.P$5 | 29.97,30.48 28.45,30.48 v27.18,29.21
ARDUINO_D21_SCL  (via drill 0.3)
  Top 0.254: v32,29.59 R7.1 | IC1.32 25.86,30.78 24.64,32 v24.64,33.4 | v28.96,33.91 31.98,33.91 v31.98,33.93
  Bottom 0.254: J3.P$6 32.38,28.45 | 32.38,28.45 32.38,29.21 v32,29.59 | v24.64,33.4 28.45,33.4 v28.96,33.91 | v31.98,33.93 33.93,33.93 34.54,33.33 35.31,32.54 35.31,29.23 34.52,28.45 32.38,28.45
GND  (via drill 0.3)
  Top 0.254: C5.2 11.31,37.84 11.81,37.34 14.1,37.34 14.61,36.83 16.51,36.83 17.27,37.59 17.27,37.72 v19.3,37.72 19.3,37.38 IC1.5 21.18,35.46 21.18,35.15 21.92,34.42 22.14,34.42 22.23,34.46 v22.23,34.42 | IC1.35 27.56,31.24 v28.32,31.24 | C2.2 C1.2 30.52,31.97 | 30.52,31.97 v31.45,31.98 | 30.52,31.97 30.48,31.75 30.48,32.51 30.86,32.89 v36.2,32.89 | v36.83,30.48 36.96,30.35 L1.2 | v25.15,34.8 24.77,35.31 25.55,36.09 IC1.42 26.3,36.87 C4.2 27.04,37.83 C11.2 | v23.62,33.66 23.11,33.66 20.45,30.99 19.71,30.99 IC1.18 18.44,29.72 17.91,29.72 16.89,28.7 C3.1 15.88,27.74 v15.88,27.69 | GND.P$1 13.59,27.18 14.35,27.18 v14.48,27.05 | v21.41,20.07 21.41,21.69 v22.48,22.61 | v15.62,14.35 17.27,12.7 18.92,12.7 20.32,14.22 v20.32,14.61 | v20.83,15.88 20.69,16.01 C17.2
  Bottom 0.254: C8.1 19.18,37.59 v19.3,37.72 | v31.45,31.98 30.71,31.24 v28.32,31.24 | v36.2,32.89 36.83,32.26 v36.83,30.48 | v22.23,34.42 23.62,34.42 | 23.62,34.42 24.77,34.42 v25.15,34.8 | v23.62,33.66 23.62,34.42 | v14.48,27.05 15.24,27.05 v15.88,27.69 | U$4.13 19.66,19.84 19.81,20.07 v21.41,20.07 | v22.48,22.61 22.1,22.61 21.59,22.99 21.59,23.86 U$4.5 | C18.2 15.11,13.97 v15.62,14.35 | v20.32,14.61 20.83,15.11 v20.83,15.88
  pour Bottom (isolate 0.254, rank 2): -0.64,-0.64 -0.64,42.55 42.55,42.55 42.55,-0.64
  pour Top (isolate 0.254, rank 2): -0.64,42.55 42.55,42.55 42.55,-0.64 -0.64,-0.64
GND2  (via drill 0.3, 0.6)
  Top 0.406: C6.2 5.46,12.18 C13.2 | R12.2 v31.5,4.19 | v25.02,4.19 R13.2
  Top 0.813: C13.2 9.55,12.18 C12.- 9.66,11.04 v10.03,10.67
  Bottom 0.406: R13.2 25.02,4.08 v25.02,4.19
  Bottom 0.61: v31.5,4.19 v25.02,4.19 | MOTOR_POWER.2 19.01,4.06 R13.2
  Bottom 0.813: v10.03,10.67 10.03,9.53 13.72,5.84 15.68,5.84 MOTOR_POWER.2
  other vias: 31.13,14.63 31.13,12.09 29.86,14.63 28.59,14.63 28.59,12.09 29.86,12.09
  pour Top (isolate 0.254): 15.75,-0.64 15.75,7.37 25.15,17.02 25.15,19.68 34.67,19.68 34.67,-0.64
  pour Bottom (isolate 0.254): 15.75,-0.64 15.75,7.37 25.15,17.02 25.15,19.68 34.67,19.68 34.67,-0.64
HEADER_MISO  (via drill 0.3)
  Top 0.254: v20.95,22.86 20.95,26.29 20.32,27.05 20.32,27.81 19.68,28.45 19.68,28.83 20.21,29.36 IC1.21
  Bottom 0.254: U$4.3 20.3,23.38 v20.95,22.86
HEADER_MOSI  (via drill 0.3)
  Top 0.254: v18.29,29.08 18.67,29.24 IC1.19
  Bottom 0.254: U$4.4 20.95,26.29 20.57,26.8 19.3,26.8 18.29,27.81 v18.29,29.08
HEADER_SCK  (via drill 0.3)
  Top 0.254: v19.05,22.48 18.8,22.48 18.29,22.99 18.29,28.15 IC1.20
  Bottom 0.254: U$4.2 19.66,23.08 v19.05,22.48
HV1  (via drill 0.3)
  Top 0.254: R21.1 10.92,33.23 Q3.3 10.16,32.72 9.78,33.02 v9.78,34.16 | J2.P$3 13.97,40.89 v11.56,38.48
  Bottom 0.254: v11.56,38.48 11.56,35.94 v9.78,34.16
HV2  (via drill 0.3)
  Top 0.254: Q4.3 12.32,33.61 R2.1 13.62,33.84 14.96,35.18 16,35.18 v16.51,35.69
  Bottom 0.254: v16.51,35.69 15.37,36.7 13.97,36.7 13.97,39.75 15.37,39.75 15.88,40.26 16.51,40.26 J2.P$4
N$1  (via drill 0.3)
  Top 0.254: LED1.C v6.99,28.96
  Bottom 0.254: v6.99,28.96 6.73,29.21 R5.2
N$2
  Top 0.406: U$1.14 30.78,7.6 R12.1
N$3
  Bottom 0.254: Q2.3 3.65,31.24 6.1,31.24 6.47,30.87 R5.1
N$4
  Top 0.406: R13.1 25.45,6.91 26.42,8 28.07,8 28.83,8.76 U$1.11
N$6
  Top 0.254: U$1.2 31.43,17.46 32,18.03 C15.1 33.03,19 R15.2
N$7  (via drill 0.3)
  Top 0.254: U3.2 U3.1 18.03,15.24 | v24.51,21.21 24.51,17.27 22.48,15.24 18.03,15.24 | J1.4 36.58,20.83 35.94,21.46 v35.94,22.23 35.88,22.28 R10.1 | 18.03,15.24 18.23,15.04 R9.1
  Bottom 0.254: v24.51,21.21 34.92,21.21 v35.94,22.23
N$13
  Top 0.406: 33.27,8.38 31.5,9.02 31.5,10.25 U$1.15
  Top 0.813: JP6.4 33.27,1.27 33.27,8.38
N$14
  Top 0.406: 25.91,8.76 27.81,8.76 28.19,9.14 28.19,10.3 U$1.10
  Top 0.813: JP6.1 23.11,1.27 23.11,7.87 24,8.76 25.91,8.76
N$15
  Top 0.406: 26.92,5.84 29.46,8.38 29.46,10.29 U$1.12
  Top 0.813: JP6.2 26.92,1.91 26.92,5.84
N$16
  Top 0.406: 28.83,4.45 28.83,6.48 30.1,7.75 30.1,10.28 U$1.13
  Top 0.813: JP6.3 28.83,4.45 28.83,4.57
N$27  (via drill 0.3)
  Top 0.254: C16.1 v21.59,19.18
  Bottom 0.254: v21.59,19.18 21.34,19.18 20.95,18.8 U$4.11
N$32
  Top 0.254: U$1.7 28.19,16.22 28.19,17.4 27.56,18.03 C14.1 26.48,18.08 R14.2
N$33  (via drill 0.3)
  Top 0.406: v10.79,17.4 Q1.3
  Bottom 0.406: F1.2 19.17,16 17.78,17.4 v10.79,17.4
N$34
  Top 0.406: R19.1 7.54,18.25 Q1.1 7.32,18.29 14.13,18.29 U3.4
N$36  (via drill 0.3)
  Top 0.406: J1.1 35.88,18.87 v35.81,18.8
  Bottom 0.406: v35.81,18.8 34.29,20.32 25.53,20.32 24.51,19.3 24.51,17.27 22.86,15.62 F1.1
PA00_XIN32  (via drill 0.3)
  Top 0.254: v16.26,38.86 20.65,38.86 IC1.1
  Bottom 0.254: Y1.2 17.21,38.93 C7.2 v16.26,38.86
PA01_XOUT32  (via drill 0.3)
  Top 0.254: v16.26,37.59 16.89,38.35 20.45,38.35 IC1.2
  Bottom 0.254: Y1.1 17.21,37.53 C8.2 v16.26,37.59
PA28_USB_HOST_EN  (via drill 0.3)
  Top 0.254: R10.2 v34.39,31.5 | v27.43,36.32 26.46,36.32 IC1.41
  Bottom 0.254: v34.39,31.5 34.39,31.8 32.92,33.3 31.34,33.3 30,34.65 29.11,34.65 v27.43,36.32
PA30_SWCLK  (via drill 0.3)
  Top 0.254: IC1.45 25.02,37.71 v25.09,37.77 | v28.57,38.35 v29.84,37.08
  Bottom 0.254: v25.09,37.77 25.27,37.97 28.07,37.97 28.45,38.35 v28.57,38.35 | v29.84,37.08 31.29,35.64 33.48,35.61 34.95,34.14 39.75,34.16 41.55,32.36 41.55,30.99 JP4.4
PA31_SWDIO
  Top 0.254: JP4.2 38.1,34.16 34.92,34.16 32.51,36.58 32.51,37.97 31.37,39.12 25.72,39.12 25.04,38.43 24.92,38.43 24.46,37.97 24.46,37.86 IC1.46
RESET  (via drill 0.3)
  Top 0.254: R1.1 4.39,30.77 D1.A v5.71,30.35 | v5.97,24 5.81,24.16 | R6.2 32.28,35.56 34.19,33.66 36.32,33.66 37.59,32.38 v37.59,32.26
  Top 0.406: 5.81,24.16 5.96,24.16 SW2.P$1 SW2.P$2
  Bottom 0.254: v5.71,30.35 5.97,30.1 v5.97,24 8.26,21.72 17.65,21.72 18.29,21.08 23.37,21.08 24.13,21.84 26.29,21.84 27.18,22.73 34.92,22.73 37.59,25.4 | v37.59,32.26 37.59,25.4 | 37.59,25.4 40.39,25.4 40.77,25.78 JP4.10
SHIELD  (2 unrouted)
  Top 0.305: 40.42,16.87 J1.S1 | 40.13,18.99 J1.S5
  Top 0.406: 40.13,18.99 J1.S1 40.42,16.97 J1.S3 | L1.1 37.47,25.97 J1.S4 37.56,23.47 J1.S8 J1.S6 J1.S5
TARGET_RESET_EDBG
  Top 0.254: IC1.40 26.66,35.81 26.92,35.81 27.18,35.56 R6.1
TARGET_USB_N
  Top 0.254: J1.2 37.3,19.52 arc-90 34.59,21.97 34.59,26.04 arc90 33.4,27.48 31.53,27.48 arc-45 28.77,28.63 IC1.33
TARGET_USB_P
  Top 0.254: J1.3 37.06,20.17 arc-90 35,21.97 35.05,26.04 arc90 33.45,27.89 31.81,27.89 arc-45 29.08,29.02 IC1.34
V+  (via drill 0.3)
  Top 0.406: C13.1 5.46,10.68 C6.1 | V+.P$3 9.53,21.72 | 9.53,21.72 V+.P$2 V+.P$1 | 14.48,9.14 21.08,9.14 21.84,9.91 v26.04,9.91 27.13,9.91 U$1.9 | U$1.16 32.11,10.31 32.51,9.91 v33.91,9.91 | C12.+ 13.07,13.46 6.22,13.46 3.94,15.75 3.94,19.56 6.1,21.72 9.53,21.72
  Top 0.813: MOTOR_POWER.1 13.23,7.9 | 13.23,7.9 14.48,9.14 14.48,12.05 C12.+ | C13.1 8.12,10.68 10.29,8.51 12.62,8.51 13.23,7.9
  Bottom 0.406: v33.91,9.91 v26.04,9.91
VDDANA
  Top 0.254: C5.1 13.13,36.84 L2.2 13.53,36.51 13.59,36.57 13.72,36.32 17.02,36.32 17.91,37.21 18.77,37.21 IC1.6
VDDCORE
  Top 0.254: IC1.43 25.68,36.95 25.68,38.12 25.78,38.23 C11.1
VIN  (via drill 0.3)
  Top 0.254: U3.5 15.08,16.16 v14.99,16.26 14.99,16 R9.2 | R21.2 R2.2 12.38,34.8 v13.34,34.8
  Top 0.406: R19.2 5.94,16.45 Q1.2 7.64,14.88 v7.62,14.61 | U3.5 16.38,16.76 16.38,17.65 14.61,19.56 VIN.P$3 VIN.P$2 VIN.P$1
  Bottom 0.254: v14.99,16.26 13.87,16.26 IC2.1 13.85,15.96 13.46,14.99 13.46,12.95 C18.1 | C9.1 11.68,15.96 IC2.3 9.75,16.1 7.94,14.29 | VIN.P$1 13.72,26.54 13.72,29.08 13.97,29.34 13.97,34.16 v13.34,34.8
  Bottom 0.406: v7.62,14.61 7.94,14.29 10.16,12.19 11.18,12.19 12.19,11.18 16,11.18 16.51,11.68 16.51,14.73 v14.99,16.26

### Text on the board
Top: Mechaduino 0.1 / Joe Church / 3/20/2016
tPlace: SWD | V+ | GND | 1 | 2 | 3 | 4
tStop: Mechaduino 0.1 / Joe Church / 3/20/2016
Reference: Joe Church